# EasyEDA Pro project 32接插板.eprj

# Schematic Schematic1

## Sheets
1 最小系统: Create Date: 2024-06-10; Page Name: 最小系统; Project Name: 32接插板; Schematic Name: Schematic1; Update Date: 2024-06-28; Company: 嘉立创EDA; Page Size: A4; Version: V1.0
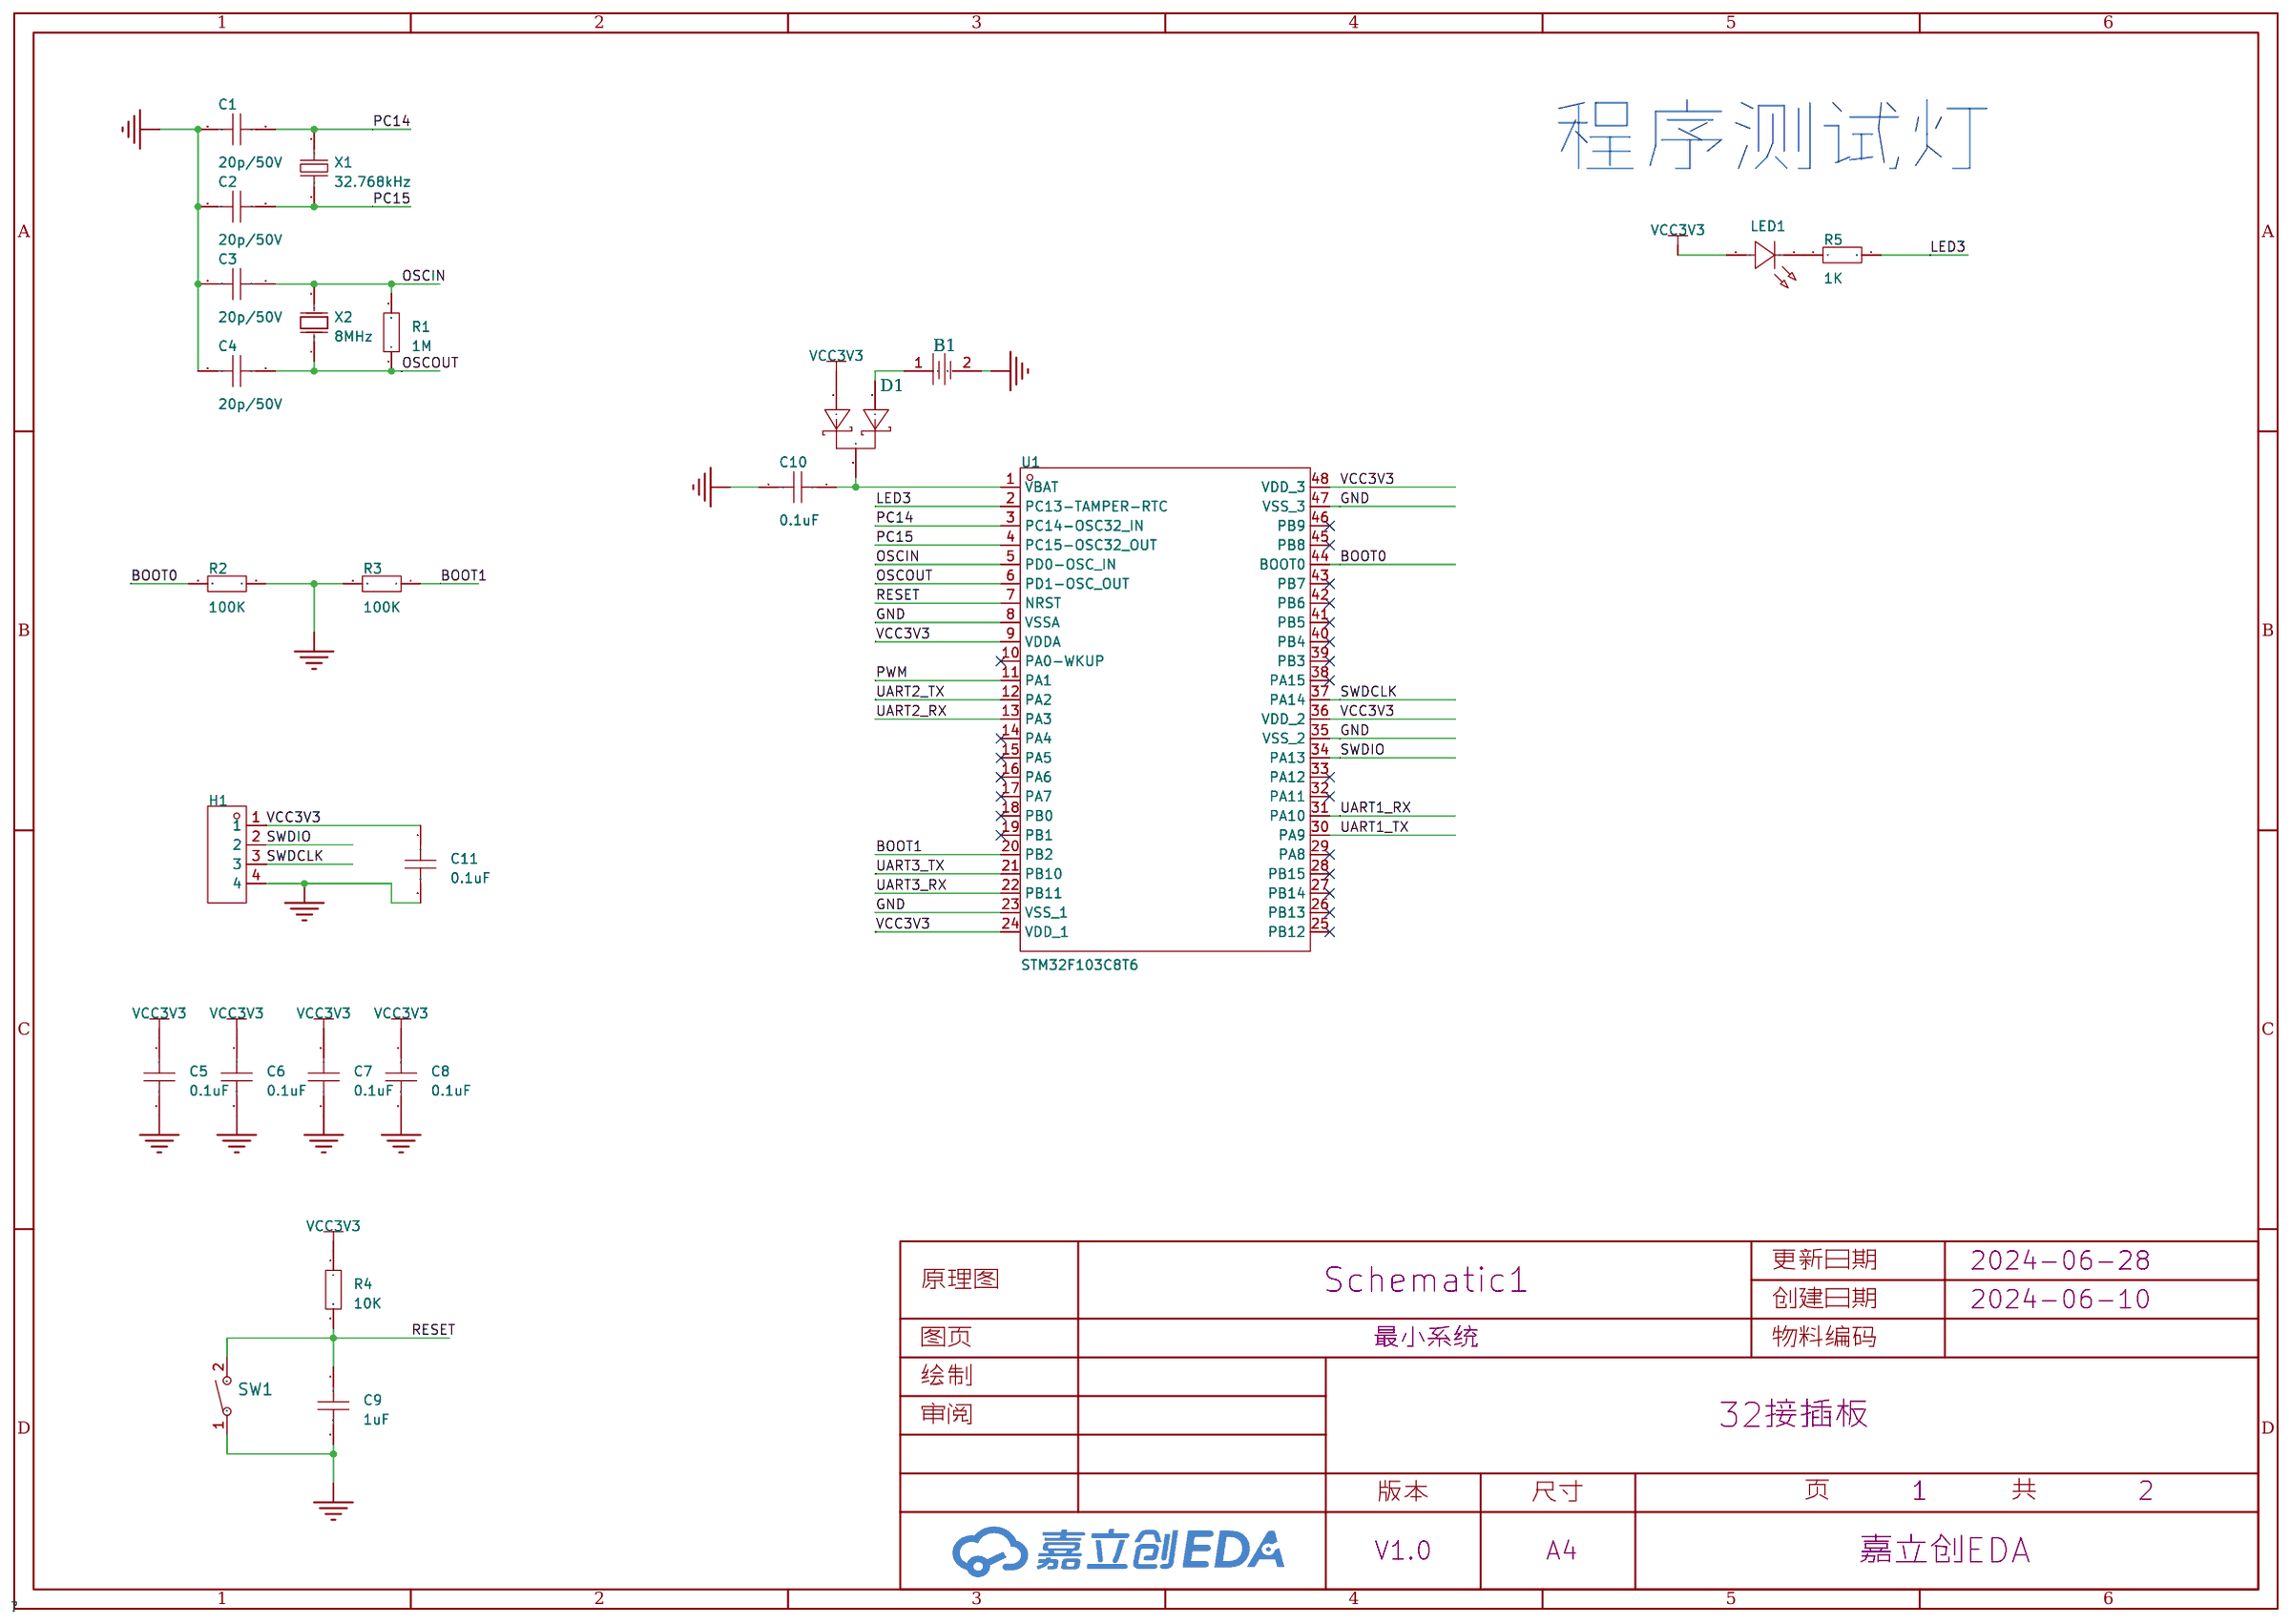
[diagram p0: 最小系统]
2 接口: Page Name: 接口
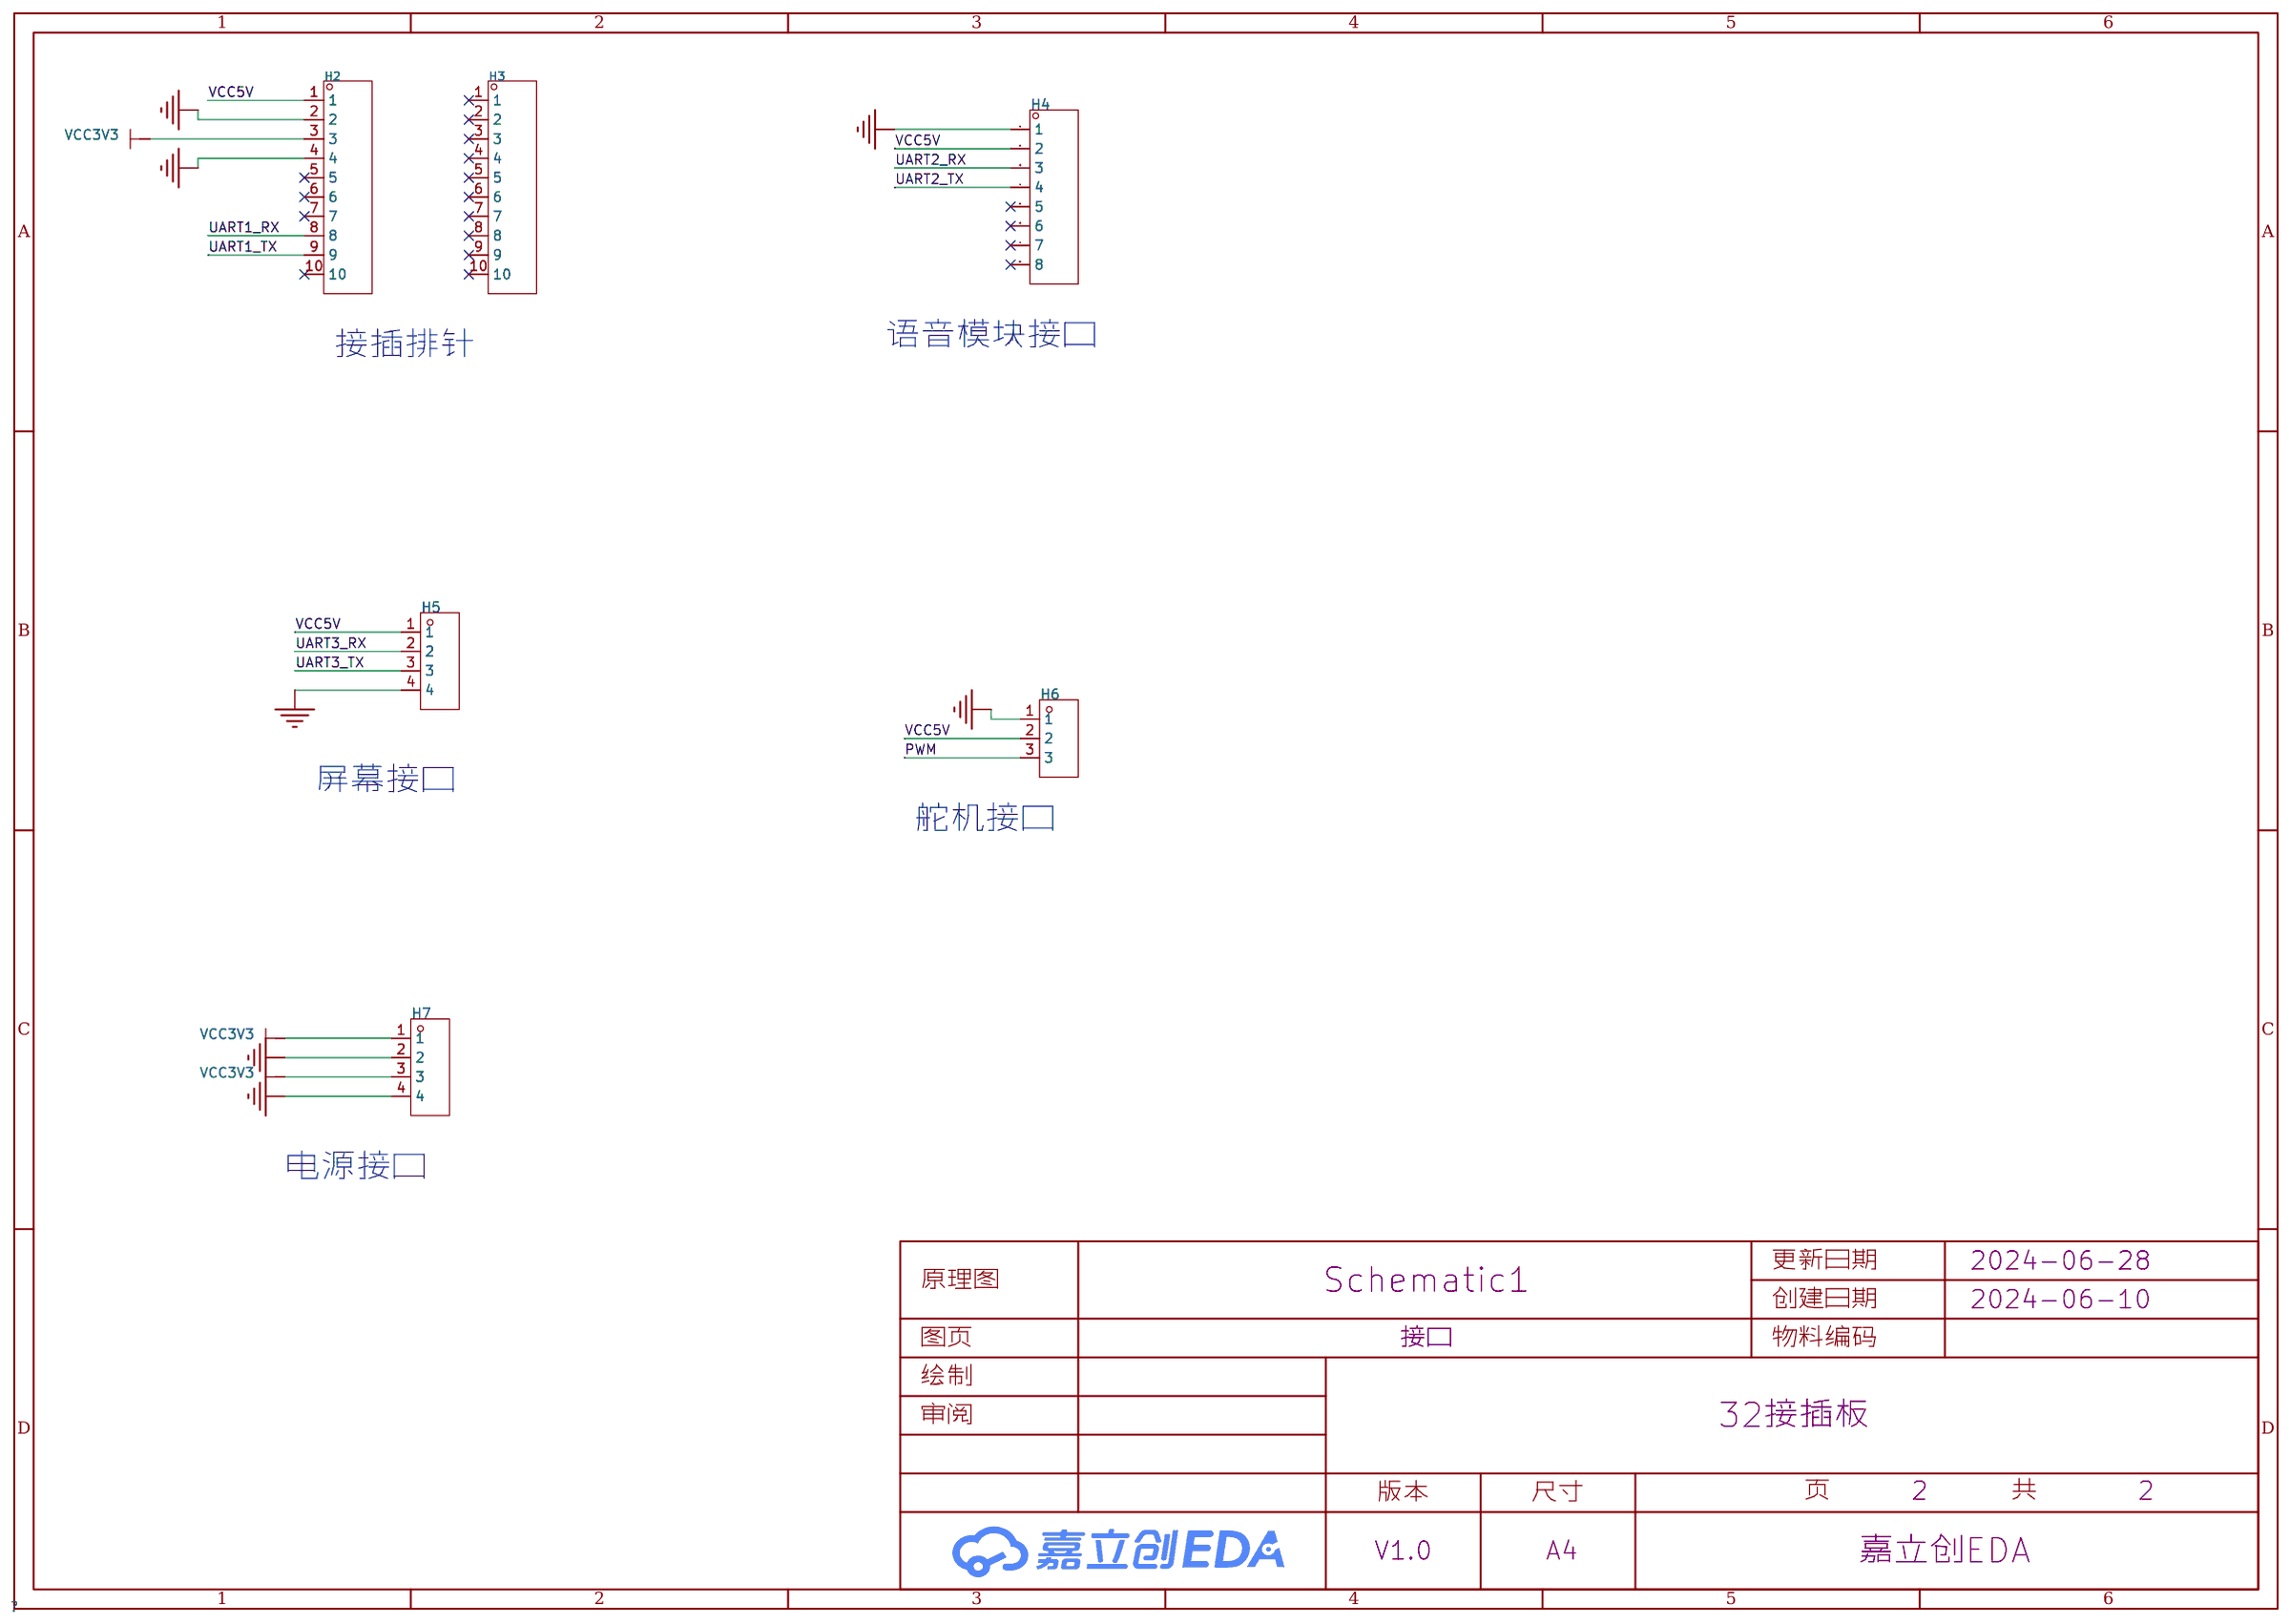
[diagram p1: 接口]

## Parts
sheet 接口
H2  -  [HDR-TH_10P-P2.54-V-M-1]
H3  -  [HDR-TH_10P-P2.54-V-M-1]
H4  -  [HDR-TH_8P-P2.54-V-M]
H5  -  [HDR-TH_4P-P2.54-V-M]
H6  -  [HDR-TH_3P-P2.54-V-M]
H7  -  [HDR-TH_4P-P2.54-V-M]
sheet 最小系统
B1  CR1220-2  [BAT-SMD_CR1220-2]
C1  10uF/10V  [C0603]
C2  10uF/10V  [C0603]
C3  10uF/10V  [C0603]
C4  10uF/10V  [C0603]
C5  10uF/10V  [C0603]
C6  10uF/10V  [C0603]
C7  10uF/10V  [C0603]
C8  10uF/10V  [C0603]
C9  10uF/10V  [C0603]
C10  10uF/10V  [C0603]
C11  10uF/10V  [C0603]
D1  bat54ct  [SOT-523-3_L1.6-W0.8-P1.00-LS1.6-BR]
H1  -  [HDR-TH_4P-P2.54-V-M]
LED1  11-21/BHC-AQ2S2/2T  [LED-SMD_L3.0-W1.5-RD]
R1  0Ω  [R0603]
R2  0Ω  [R0603]
R3  0Ω  [R0603]
R4  0Ω  [R0603]
R5  0Ω  [R0603]
SW1  按键贴片两脚（TS-1092S-B3D2-G ）  [SW-SMD_L6.1-W3.6-LS7.9]
U1  STM32F103C8T6  [LQFP-48_L7.0-W7.0-P0.50-LS9.0-BL]
X1  32.768kHz  [FC-135R_L3.2-W1.5]
X2  8MHz  [CRYSTAL-SMD_L5.0-W3.2]

## Library data of the parts
H2 H3 = HDR-M_2.54_1x10P: Supplier Part: C57369; Supplier Footprint: 插件
H4 = HDR-M_2.54_1x8P: Supplier Part: C124381; Supplier Footprint: 插件
H1 H5 H7 = HDR-M_2.54_1x4P: Supplier Part: C492403; Supplier Footprint: 插件
H6 = HDR-M_2.54_1x3P: Supplier Part: C2937625; Supplier Footprint: 插件
B1 = CR1220-2: 连接器类型:电池底座;适用电池规格:CR1220;工作温度范围:-;; LCSC Part Name: 电池底座 适用电池:CR1220; Supplier Part: C70381; Manufacturer: QJ; Supplier Footprint: SMD; JLCPCB Part Class: Extended Part; Datasheet: https://atta.szlcsc.com/upload/public/pdf/source/20160427/1461725216696.pdf; Supplier: LCSC; Connector Type: 电池底座; Battery Type: CR1220
C1-C11 = CL10A106KP8NNNC: 容值:10uF;精度:±10%;额定电压:10V;材质(温度系数):X5R;; LCSC Part Name: 10uF ±10% 10V; Supplier Part: C19702; Manufacturer: SAMSUNG(三星); Supplier Footprint: 0603; JLCPCB Part Class: 基础库; Datasheet: https://atta.szlcsc.com/upload/public/pdf/source/20160103/1457707703378.pdf; Supplier: LCSC; Tolerance: ±10%; Voltage Rated: 10V; Temperature Coefficient: X5R
D1 = bat54ct: 直流反向耐压(Vr):30V;平均整流电流(Io):200mA;正向压降(Vf):1V@100mA;; LCSC Part Name: 30V 200mA 1V@100mA; Supplier Part: C77320; Manufacturer: CJ（江苏长电/长晶）; Manufacturer Part: BAT54CT; LCSC On Sale: 1; Supplier Footprint: SOT-523; JLCPCB On Sale: 1; Datasheet: https://atta.szlcsc.com/upload/public/pdf/source/20160702/1467448302636.pdf; Supplier: LCSC; Reverse Voltage (Vr): 30V; Average Rectified Current (Io): 200mA; Forward Voltage (Vf@If): 1V@100mA; JLCPCB Part Class: Extended Part
LED1 = 11-21/BHC-AQ2S2/2T: LCSC Part Name: Led; Supplier Part: C3014404; Manufacturer: EVERLIGHT(亿光); Supplier Footprint: SMD,1.5x3mm; JLCPCB Part Class: Extended Part; Datasheet: https://atta.szlcsc.com/upload/public/pdf/source/20220513/A56B845CA083C4E68F88D304929CC0C5.pdf; Supplier: LCSC
R1-R5 = 0603WAF0000T5E: 电阻类型:厚膜电阻;阻值:0Ω;精度:±1%;功率:100mW;; LCSC Part Name: 0Ω ±1% 100mW; Supplier Part: C21189; Manufacturer: UNI-ROYAL(厚声); Supplier Footprint: 0603; JLCPCB Part Class: Basic Part; Datasheet: https://atta.szlcsc.com/upload/public/pdf/source/20200306/C422600_1E6D84923E4A46A82E41ADD87F860B5C.pdf; Supplier: LCSC; Tolerance: ±1%; Power(Watts): 100mW; Overload Voltage (Max): 75V; Type: 厚膜电阻; Operating Temperature Range: -55℃~+155℃
SW1 = 按键贴片两脚（TS-1092S-B3D2-G ）: link: https://item.szlcsc.com/537806.html; 3DModel: KEY-SMD_2P-L6.0-W3.6-H2.5-LS8.0; Supplier: LCSC; Supplier Part: C520860; Manufacturer: Yuandi; Manufacturer Part: TS-1092S-B3D2-G; JLCPCB Part Class: Extended Part
U1 = STM32F103C8T6: CPU内核:CM3;程序存储容量:64KB;RAM总容量:20KB;GPIO端口数量:37;工作电压范围:2V~3.6V;CPU最大主频:72MHz;程序存储器类型:FLASH;; LCSC Part Name: STM32F103C8T6 MSL=3; Supplier Part: C8734; Manufacturer: ST(意法半导体); Supplier Footprint: LQFP-48(7x7); JLCPCB Part Class: 扩展库; Datasheet: https://atta.szlcsc.com/upload/public/pdf/source/20220812/8363ACEC51AD55ECEB84799464F7CB85.pdf; Supplier: LCSC; CPU Core: CM3; Program Storage Size: 64KB; RAM Size: 20KB; GPIO Ports Number: 37; Operating Voltage Range: 2V~3.6V; CPU Maximum Speed: 72MHz; Program Memory Type: FLASH; Operating Temperature Range: -40℃~+85℃; ADC (Bit): 12bit; Universal Serial Bus: 有; Peripheral/Function: 看门狗；DMA；看门狗；片载温度传感器; Watchdog: 有; Infrared Data Association: 有; Low-Voltage Detect: 有; Direct Memory Access: 有; Internal Oscillator: 有
X1 = Q13FC13500004_C32346: 晶振类型:贴片晶振;频率:32.768kHz;常温频差:±20ppm;外接负载电容:12.5pF;; LCSC Part Name: 32.768kHz ±20ppm 12.5pF; Supplier Part: C32346; Manufacturer: EPSON(爱普生); Manufacturer Part: Q13FC13500004; Supplier Footprint: SMD3215-2P; JLCPCB Part Class: 基础库; Datasheet: https://atta.szlcsc.com/upload/public/pdf/source/20190108/C32346_746D6B07EAF90824457A96480007685F.pdf; Supplier: LCSC; Crystal Type: 贴片晶振; Normal temperature Frequency Tolerance: ±20ppm; External load capacitor: 12.5pF; Equivalent Series Resistance (ESR): 70kΩ; Operating Temperature: -40℃~+85℃
X2 = X50328MSB2GI: 晶振类型:贴片晶振;频率:8MHz;常温频差:±10ppm;外接负载电容:20pF;频率稳定度(全温):±20ppm;; LCSC Part Name: 8MHz ±10ppm 20pF YSX530GA; Supplier Part: C115962; Manufacturer: YXC(扬兴晶振); Supplier Footprint: SMD5032; JLCPCB Part Class: 基础库; Datasheet: https://atta.szlcsc.com/upload/public/pdf/source/20240329/44922B0AF7B60E58E9B66993B6077277.pdf; Supplier: LCSC; Crystal Type: 贴片晶振; Normal temperature Frequency Tolerance: ±10ppm; External load capacitor: 20pF; Frequency Stability(Full temperature range): ±20ppm; Operating Temperature: -40℃~+85℃

## Nets
GND: B1.2 C1.2 C2.2 C3.2 C4.2 C5.2 C6.2 C7.2 C8.2 C9.2 C10.2 C11.2 H1.4 H2.2 H2.4 H4.1 H5.4 H6.1 H7.2 H7.4 R2.1 R3.2 SW1.1 U1.8(VSSA) U1.23(VSS_1) U1.35(VSS_2) U1.47(VSS_3)
VCC3V3: C5.1 C6.1 C7.1 C8.1 C11.1 D1.2(A) H1.1 H2.3 H7.1 H7.3 LED1.2(A) R4.1 U1.9(VDDA) U1.24(VDD_1) U1.36(VDD_2) U1.48(VDD_3)
VCC5V: H2.1 H4.2 H5.1 H6.2
BOOT0: R2.2 U1.44(BOOT0)
BOOT1: R3.1 U1.20(PB2)
LED3: R5.1 U1.2(PC13-TAMPER-RTC)
OSCIN: C3.1 R1.2 U1.5(PD0-OSC_IN) X2.2(OSC2)
OSCOUT: C4.1 R1.1 U1.6(PD1-OSC_OUT) X2.1(OSC1)
PC14: C1.1 U1.3(PC14-OSC32_IN) X1.1
PC15: C2.1 U1.4(PC15-OSC32_OUT) X1.2
PWM: H6.3 U1.11(PA1)
RESET: C9.1 R4.2 SW1.2 U1.7(NRST)
SWDCLK: H1.3 U1.37(PA14)
SWDIO: H1.2 U1.34(PA13)
UART1_RX: H2.8 U1.31(PA10)
UART1_TX: H2.9 U1.30(PA9)
UART2_RX: H4.3 U1.13(PA3)
UART2_TX: H4.4 U1.12(PA2)
UART3_RX: H5.2 U1.22(PB11)
UART3_TX: H5.3 U1.21(PB10)
$1N2470: C10.1 D1.3(K) U1.1(VBAT)
$1N2542: LED1.1(K) R5.2
$1N2701: B1.1 D1.1(A)

Not connected (* = marked no-connect by the designer): H2 5* 6* 7* 10*; H3 1* 2* 3* 4* 5* 6* 7* 8* 9* 10*; H4 5* 6* 7* 8*; U1 10(PA0-WKUP)* 14(PA4)* 15(PA5)* 16(PA6)* 17(PA7)* 18(PB0)* 19(PB1)* 25(PB12)* 26(PB13)* 27(PB14)* 28(PB15)* 29(PA8)* 32(PA11)* 33(PA12)* 38(PA15)* 39(PB3)* 40(PB4)* 41(PB5)* 42(PB6)* 43(PB7)* 45(PB8)* 46(PB9)*

## Notes on the sheets
sheet 1
- 程序测试灯
sheet 2
- 接插排针
- 语音模块接口
- 屏幕接口
- 舵机接口
- 电源接口

# Board PCB1
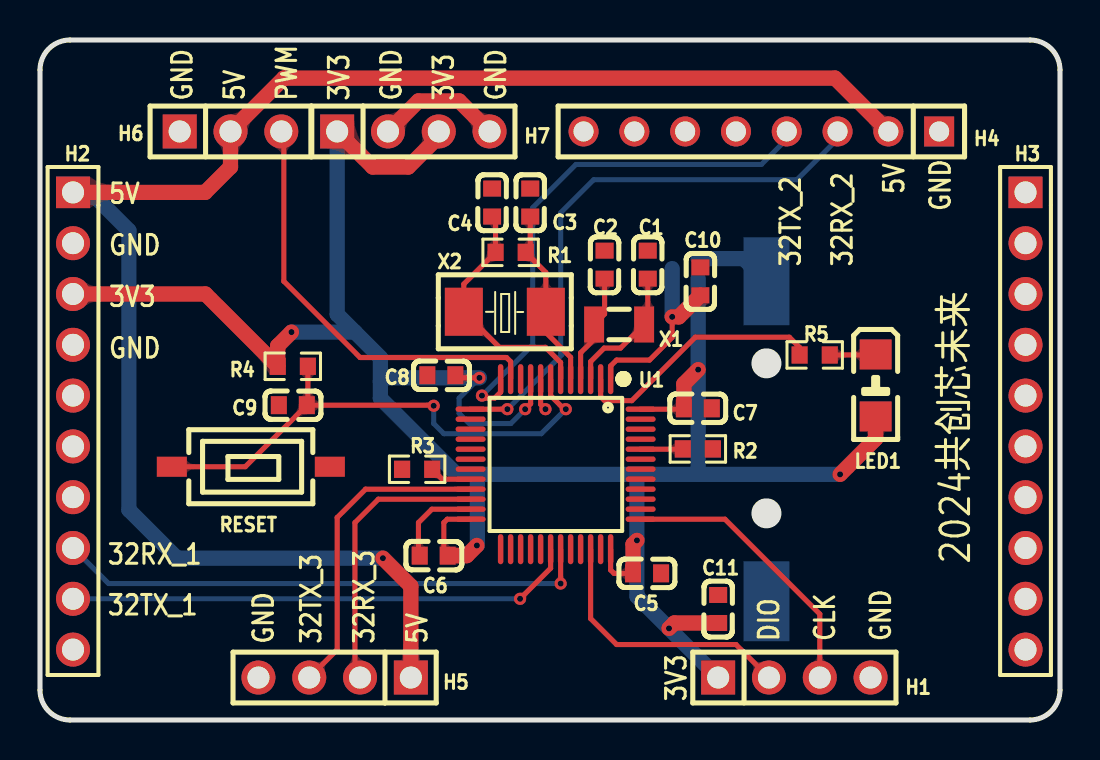
[diagram p2: board, top side]
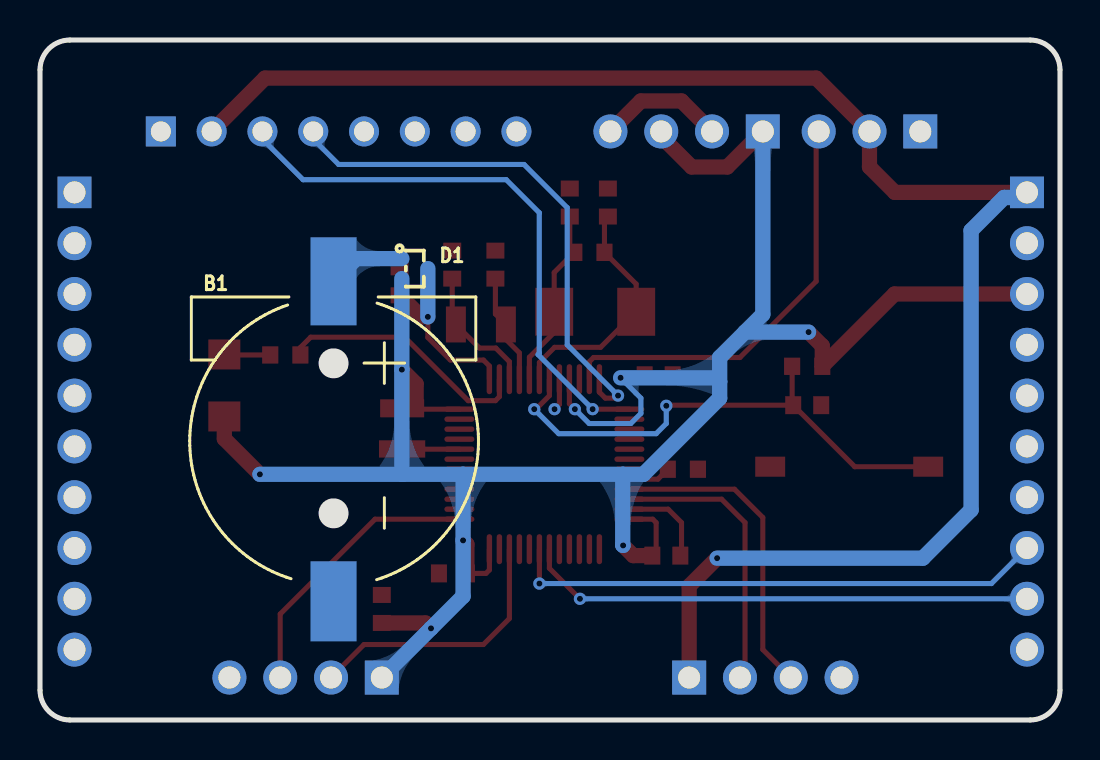
[diagram p3: board, bottom side, seen from below]

Outline 51 x 34 mm; copper layers: Top Layer, Bottom Layer. Coordinates in mm from the lower left corner of the outline.
Outline path: 0,32.5 0,1.5 arc(0.44,0.44) 1.5,0 49.5,0 arc(50.56,0.44) 51,1.5 51,32.5 arc(50.56,33.56) 49.5,34 1.5,34 arc(0.44,33.56) 0,32.5
Stack: Top Layer 0.035mm / Dielectric1 1.51mm FR4 er 4.5 / Bottom Layer 0.035mm

## Design rules (mm)
template: JLCPCB Capability(Two Layers Board)
spacing copperThickness1oz (default): track to track 0.102, other pairs 0.152 to 0.3
spacing copperThickness2oz: track to track 0.203, other pairs 0.152 to 0.3
track width copperThickness1oz (default): min 0.127, default 0.254, max 2.54
track width copperThickness2oz: min 0.203, default 0.254, max 2.54
differential pair differentialPair (default): width min 0.127, default 0.254, max 2.54; gap min 0.152, default 0.152
via viaSize (default): diameter min 0.5, default 0.61, max 10; hole min 0.3, default 0.305, max 6.3

## Placement (name value [footprint] x y rotation side)
B1  CR1220-2  [BAT-SMD_CR1220-2]  36.32 13.93 270 bottom
C1  10uF/10V  [C0603]  30.39 22.77 90 top
C2  10uF/10V  [C0603]  28.23 22.77 90 top
C3  10uF/10V  [C0603]  24.51 25.87 90 top
C4  10uF/10V  [C0603]  22.61 25.87 90 top
C5  10uF/10V  [C0603]  30.35 7.33 0 top
C6  10uF/10V  [C0603]  19.69 8.22 180 top
C7  10uF/10V  [C0603]  32.89 15.58 0 top
C8  10uF/10V  [C0603]  20.07 17.24 180 top
C9  10uF/10V  [C0603]  12.64 15.74 180 top
C10  10uF/10V  [C0603]  33.02 21.94 90 top
C11  10uF/10V  [C0603]  33.91 5.55 90 top
D1  bat54ct  [SOT-523-3_L1.6-W0.8-P1.00-LS1.6-BR]  32.26 22.57 0 bottom
H1  -  [HDR-TH_4P-P2.54-V-M]  37.72 2.12 0 top
H2  -  [HDR-TH_10P-P2.54-V-M-1]  1.65 14.95 270 top
H3  -  [HDR-TH_10P-P2.54-V-M-1]  49.28 14.95 270 top
H4  -  [HDR-TH_8P-P2.54-V-M]  36.07 29.43 180 top
H5  -  [HDR-TH_4P-P2.54-V-M]  14.73 2.12 180 top
H6  -  [HDR-TH_3P-P2.54-V-M]  9.53 29.43 0 top
H7  -  [HDR-TH_4P-P2.54-V-M]  18.67 29.43 0 top
LED1  11-21/BHC-AQ2S2/2T  [LED-SMD_L3.0-W1.5-RD]  41.78 16.73 270 top
R1  0Ω  [R0603]  23.53 23.38 0 top
R2  0Ω  [R0603]  32.89 13.55 180 top
R3  0Ω  [R0603]  18.86 12.54 180 top
R4  0Ω  [R0603]  12.64 17.69 0 top
R5  0Ω  [R0603]  38.74 18.25 0 top
RESET  按键贴片两脚（TS-1092S-B3D2-G ）  [SW-SMD_L6.1-W3.6-LS7.9]  10.54 12.66 180 top
U1  STM32F103C8T6  [LQFP-48_L7.0-W7.0-P0.50-LS9.0-BL]  25.78 12.79 180 top
X1  32.768kHz  [FC-135R_L3.2-W1.5]  28.96 19.78 180 top
X2  8MHz  [CRYSTAL-SMD_L5.0-W3.2]  23.24 20.41 0 top

## Footprints (pads in the part's own frame, mm; a bottom-side part is the same pattern mirrored in y, then rotated)
BAT-SMD_CR1220-2
  rect 4.4x2.3 smd: 1(-8,0)
  rect 4x2.3 smd: 2(8,0)
C0603
  rect 0.8x0.9 smd: 1(-0.7,0) 2(0.7,0)
CRYSTAL-SMD_L5.0-W3.2
  rect 1.9x2.4 smd: 1(-2.05,0) 2(2.05,0)
FC-135R_L3.2-W1.5
  rect 1x1.8 smd: 1(-1.25,0) 2(1.25,0)
HDR-TH_3P-P2.54-V-M
  rect 1.7x1.7 hole 1.1: 1(-2.54,0)
  round 1.7 hole 1.1: 2(0,0) 3(2.54,0)
HDR-TH_4P-P2.54-V-M
  rect 1.7x1.7 hole 1.1: 1(-3.81,0)
  round 1.7 hole 1.1: 2(-1.27,0) 3(1.27,0) 4(3.81,0)
HDR-TH_8P-P2.54-V-M
  rect 1.5x1.5 hole 1: 1(-8.89,0)
  round 1.5 hole 1: 2(-6.35,0) 3(-3.81,0) 4(-1.27,0) 5(1.27,0) 6(3.81,0) 7(6.35,0) 8(8.89,0)
HDR-TH_10P-P2.54-V-M-1
  rect 1.575x1.7 hole 1.1: 1(-11.43,0)
  round 1.7 hole 1.1: 2(-8.89,0) 3(-6.35,0) 4(-3.81,0) 5(-1.27,0) 6(1.27,0) 7(3.81,0) 8(6.35,0) 9(8.89,0) 10(11.43,0)
LED-SMD_L3.0-W1.5-RD
  rect 1.5x1.6 smd: 1(-1.55,0) 2(1.55,0)
LQFP-48_L7.0-W7.0-P0.50-LS9.0-BL
  oval 0.27x1.5 smd: 1(-2.75,-4.25) 2(-2.25,-4.25) 3(-1.75,-4.25) 4(-1.25,-4.25) 5(-0.75,-4.25) 6(-0.25,-4.25) 7(0.25,-4.25) 8(0.75,-4.25) 9(1.25,-4.25) 10(1.75,-4.25) 11(2.25,-4.25) 12(2.75,-4.25) 25(2.75,4.25) 26(2.25,4.25) 27(1.75,4.25) 28(1.25,4.25) 29(0.75,4.25) 30(0.25,4.25) 31(-0.25,4.25) 32(-0.75,4.25) 33(-1.25,4.25) 34(-1.75,4.25) 35(-2.25,4.25) 36(-2.75,4.25)
  oval 1.5x0.27 smd: 13(4.25,-2.75) 14(4.25,-2.25) 15(4.25,-1.75) 16(4.25,-1.25) 17(4.25,-0.75) 18(4.25,-0.25) 19(4.25,0.25) 20(4.25,0.75) 21(4.25,1.25) 22(4.25,1.75) 23(4.25,2.25) 24(4.25,2.75) 37(-4.25,2.75) 38(-4.25,2.25) 39(-4.25,1.75) 40(-4.25,1.25) 41(-4.25,0.75) 42(-4.25,0.25) 43(-4.25,-0.25) 44(-4.25,-0.75) 45(-4.25,-1.25) 46(-4.25,-1.75) 47(-4.25,-2.25) 48(-4.25,-2.75)
R0603
  rect 0.806x0.864 smd: 1(-0.753,0) 2(0.753,0)
SOT-523-3_L1.6-W0.8-P1.00-LS1.6-BR
  rect 0.51x0.4 smd: 1(0.65,-0.5) 2(0.65,0.5) 3(-0.65,0)
SW-SMD_L6.1-W3.6-LS7.9
  rect 1.5x1 smd: 1(-3.95,0) 2(3.95,0)

## Nets
As in the schematic, except:
GND: B1.2 C1.2 C2.2 C3.2 C4.2 C5.2 C6.2 C7.2 C8.2 C9.2 C10.2 C11.2 H1.4 H2.2 H2.4 H4.1 H5.4 H6.1 H7.2 H7.4 R2.1 R3.2 RESET.1 U1.8 U1.23 U1.35 U1.47
RESET: C9.1 R4.2 RESET.2 U1.7

Pads without a net: H2 5 6 7 10; H3 1 2 3 4 5 6 7 8 9 10; H4 5 6 7 8; U1 10 14 15 16 17 18 19 25 26 27 28 29 32 33 38 39 40 41 42 43 45 46

## Via types
v1: diameter 0.61, hole 0.305, Top Layer to Bottom Layer, 17 vias

## Routing (per net, layer and track width the routed paths; a pad name or vN(x,y) marks a point on that pad's centre or on a via; arc(x,y) is an arc through that point)
GND: length 12.5
  Top Layer w0.254: C6.2 18.92,8.28 18.92,9.87 19.59,10.54 U1.23 ; v1(25.27,15.54) 25.03,15.78 U1.8
  Top Layer w0.762: H7.2 18.92,30.95 20.96,30.95 H7.4
VCC3V3: length 120.9
  Top Layer w0.254: v1(24.26,15.54) 24.53,15.81 U1.9 ; U1.24 20.36,10.04 20.19,9.87 20.19,8.41 C6.1 ; C8.1 20.89,17.11 v1(21.97,17.11) ; 29.65,7.33 28.7,7.33 28.53,7.5 U1.36 ; C7.1 32.15,15.54 U1.48
  Top Layer w0.762: v1(31.45,4.58) 31.72,4.85 C11.1 ; H7.3 19.94,29.17 18.41,27.65 16.64,27.65 H7.1 ; LED1.2 41.78,14.06 v1(40,12.28) ; v1(29.85,8.98) 29.65,8.79 29.65,7.33 ; v1(21.84,8.73) 21.34,8.22 C6.1 ; H2.3 8.27,21.3 R4.1 11.89,18.71 v1(12.57,19.39) ; C7.1 32.19,16.8 v1(32.91,17.52)
  Bottom Layer w0.254: v1(24.26,15.54) 23.54,14.82 21.46,14.82 20.96,15.33 20.96,16.09 v1(21.97,17.11)
  Bottom Layer w0.762: 32.88,12.28 32.91,12.31 v1(32.91,17.52) D1.2 ; 32.88,12.28 v1(40,12.28) ; 32.88,12.28 29.85,12.28 ; 21.87,12.28 20.83,12.28 17.02,16.09 17.02,16.92 ; 21.87,12.28 29.85,12.28 ; 21.87,12.28 21.87,8.75 v1(21.84,8.73) ; v1(21.97,17.11) 17.21,17.11 17.02,16.92 ; 17.02,16.92 17.02,18.12 15.75,19.39 ; 29.85,12.28 v1(29.85,8.98) 29.85,6.19 v1(31.45,4.58) H1.1 ; v1(12.57,19.39) 15.75,19.39 ; 15.75,19.39 14.86,20.28 H7.1
VCC5V: length 83.1
  Top Layer w0.762: H5.1 18.54,6.69 v1(17.15,8.09) ; H4.2 39.75,32.09 12.19,32.09 H6.2 9.53,27.65 8.25,26.38 H2.1
  Bottom Layer w0.762: H2.1 1.91,26.13 2.79,26.13 4.44,24.47 4.44,10.5 6.86,8.09 v1(17.15,8.09)
BOOT0: length 2.1
  Top Layer w0.254: U1.44 32.13,13.54 R2.2
BOOT1: length 2.1
  Top Layer w0.254: R3.1 20.11,12.04 U1.20
LED3: length 12.8
  Top Layer w0.254: U1.2 28.03,16.16 28.23,15.97 29.59,15.97 32.77,19.14 37.47,19.14 37.98,18.62 R5.1
OSCIN: length 9.2
  Top Layer w0.254: C3.1 24.51,23.61 R1.2 25.29,22.38 X2.2 25.29,19.38 26.53,18.14 U1.5
OSCOUT: length 12.2
  Top Layer w0.254: U1.6 26.03,17.88 25.27,18.63 22.97,18.63 X2.1 21.19,21.8 R1.1 22.78,25 C4.1
PC14: length 6.7
  Top Layer w0.254: U1.3 27.53,17.92 28.21,18.6 29.03,18.6 X1.1 30.39,19.96 C1.1
PC15: length 5.5
  Top Layer w0.254: U1.4 27.03,18.36 27.71,19.03 X1.2 28.23,20.3 C2.1
PWM: length 21.4
  Top Layer w0.254: H6.3 12.19,29.3 12.19,21.94 16,18.12 23.32,18.12 23.53,17.92 U1.11
RESET: length 26.4
  Top Layer w0.254: C9.1 13.39,15.79 R4.2 ; C9.1 10.26,12.66 RESET.2 ; C9.1 19.66,15.74 v1(19.69,15.71) ; v1(26.29,15.54) 26.21,15.54 25.53,16.22 U1.7
  Bottom Layer w0.254: v1(26.29,15.54) 25.06,14.31 20.19,14.31 19.69,14.82 v1(19.69,15.71)
SWDCLK: length 14.1
  Top Layer w0.254: H1.3 38.99,5.3 34.25,10.04 U1.37
SWDIO: length 13.6
  Top Layer w0.254: U1.34 27.53,5.07 28.83,3.77 34.8,3.77 H1.2
UART1_RX: length 26.8
  Top Layer w0.254: U1.31 v1(26.03,6.82)
  Bottom Layer w0.254: H2.8 3.43,6.82 v1(26.03,6.82)
UART1_TX: length 25.5
  Top Layer w0.254: U1.30 25.53,7.59 v1(24,6.06)
  Bottom Layer w0.254: v1(24,6.06) H2.9
UART2_RX: length 28.6
  Top Layer w0.254: U1.13 v1(23.37,15.54)
  Bottom Layer w0.254: v1(23.37,15.54) 26.1,18.27 26.03,18.33 26.03,25.36 27.69,27.02 37.85,27.02 39.88,29.05 H4.3
UART2_TX: length 26.7
  Top Layer w0.254: U1.12 23.03,16.39 22.73,16.09 22.22,16.09 v1(22.1,16.22)
  Bottom Layer w0.254: H4.4 37.34,29.05 36.07,27.78 26.8,27.78 24.64,25.62 24.64,18.76 v1(22.1,16.22)
UART3_RX: length 14.1
  Top Layer w0.254: U1.22 16.92,11.04 15.75,9.87 15.75,2.38 H5.2
UART3_TX: length 15.8
  Top Layer w0.254: H5.3 14.86,3.52 14.86,10.12 16.28,11.54 U1.21
$1N2470: length 9.6
  Top Layer w0.254: U1.1 28.53,17.7 28.83,18 30.48,18 31.61,19.13 v1(31.61,20.16)
  Top Layer w0.762: v1(31.61,20.16) 31.94,20.16 C10.1
  Bottom Layer w0.762: D1.3 v1(31.61,20.16)
$1N2542: length 2.3
  Top Layer w0.254: LED1.1 41.76,18.25 R5.2
$1N2701: length 3.9
  Bottom Layer w0.762: B1.1 35.19,23.07 D1.1

## Copper pours and planes (outline as drawn; the poured copper is in the pictures)
GND on Top Layer: -3.81,35.52 55.63,35.52 55.63,-1.94 -3.81,-1.94
GND on Bottom Layer: -0.89,37.3 52.07,37.3 52.07,-4.1 -0.89,-4.1

Small or netless copper shapes (teardrops, artwork), in the pictures only: 82 on Top Layer, 21 on Bottom Layer

## Text on the board
Top Silkscreen Layer: 32RX_1 | 32TX_1 | 5V | GND | 3V3 | PWM | 32TX_3 | 32RX_3 | DIO | 32TX_2 | CLK | 32RX_2 | 2024共创芯未来
